# Altium schematic sheet 03200904张晨06.SchDoc
size A4; SheetNumber: 1; SheetTotal: 1
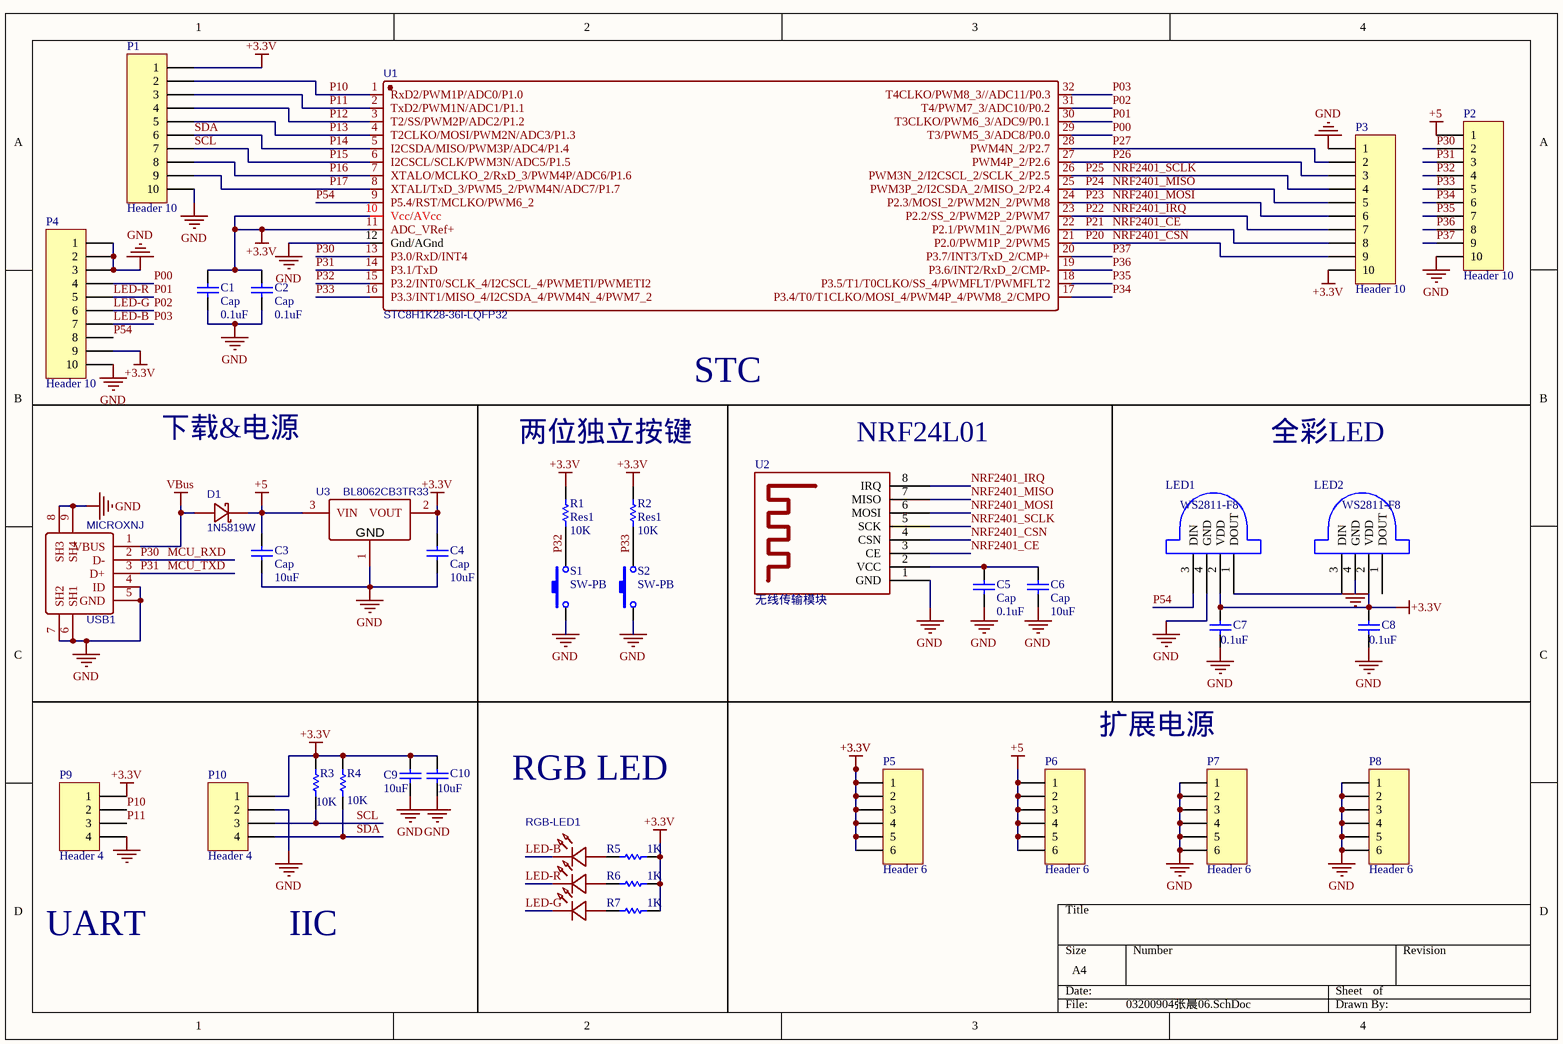
[diagram p0: 03200904张晨06.SchDoc]

## Parts
C1  Cap  value 0.1uF  [C0603]
C2  Cap  value 0.1uF  [C0603]
C3  Cap  value 10uF  [C0603]
C4  Cap  value 10uF  [C0603]
C5  Cap  value 0.1uF  [C0603]
C6  Cap  value 10uF  [C0603]
C7  value 0.1uF  [C0603]  (hidden comment: Cap)
C8  value 0.1uF  [C0603]  (hidden comment: Cap)
C9  value 10uF  [C0603]  (hidden comment: Cap)
C10  value 10uF  [C0603]  (hidden comment: Cap)
D1  1N5819W  [SOD-123_L2.8-W1.8-LS3.7-RD]
LED1  WS2811-F8  [WS2811-F8]
LED2  WS2811-F8  [WS2811-F8]
P1  Header 10  [HDR1X10]
P2  Header 10  [HDR1X10]
P3  Header 10  [HDR1X10]
P4  Header 10  [HDR1X10]
P5  Header 6  [HDR1X6]
P6  Header 6  [HDR1X6]
P7  Header 6  [HDR1X6]
P8  Header 6  [HDR1X6]
P9  Header 4  [HDR1X4]
P10  Header 4  [HDR1X4]
R1  Res1  value 10K  [R0603]
R2  Res1  value 10K  [R0603]
R3  value 10K  [R0603]  (hidden comment: Res1)
R4  value 10K  [R0603]  (hidden comment: Res1)
R5  value 1K  [R0603]  (hidden comment: Res1)
R6  value 1K  [R0603]  (hidden comment: Res1)
R7  value 1K  [R0603]  (hidden comment: Res1)
RGB-LED1  TC5050RGBF20-3CES-AF51  [LED-SMD_6P-L5.0-W5.0-FD]  (value not drawn)
S1  SW-PB  [SW-PB]
S2  SW-PB  [SW-PB]
U1  STC8H1K28-36I-LQFP32  [STC8H1K28I-LQFP-32]
U2  无线传输模块  [无线传输]
U3  BL8062CB3TR33  [SOT-23-3_L2.9-W1.6-P1.90-LS2.8-BR]
USB1  MICROXNJ  [MICRO-USB-SMD_MICROXNJ]

## Nets
+3.3V: C1.1 C2.1 C4.1 C7.1 C8.1 C9.2 C10.2 LED1.2(VDD) LED2.2(VDD) P1.1 P3.10 P4.9 P5.1 P5.2 P5.3 P5.4 P5.5 P5.6 P9.1 P10.1 R1.2 R2.2 R3.1 R4.1 R5.2 R6.2 R7.2 U1.10(Vcc/AVcc) U1.11(ADC_VRef+) U3.2(VOUT)
+5: C3.1 D1.1(C) P2.1 P6.1 P6.2 P6.3 P6.4 P6.5 P6.6 U3.3(VIN)
GND: C1.2 C2.2 C3.2 C4.2 C5.1 C6.1 C7.2 C8.2 C9.1 C10.1 LED1.4(GND) LED2.4(GND) P1.10 P2.10 P3.1 P4.1 P4.2 P4.3 P4.10 P7.1 P7.2 P7.3 P7.4 P7.5 P7.6 P8.1 P8.2 P8.3 P8.4 P8.5 P8.6 P9.4 P10.2 S1.1 S2.1 U1.12(Gnd/AGnd) U2.1(GND) U3.1(GND) USB1.4(ID) USB1.5(GND) USB1.6(SH1) USB1.7(SH2) USB1.8(SH3) USB1.9(SH4)
VBus: D1.2(A) USB1.1(VBUS)
LED-B: P4.7 RGB-LED1.6(K) U1.32(T4CLKO/PWM8_3//ADC11/P0.3)  [also labelled P03]
LED-G: P4.6 RGB-LED1.4(K) U1.31(T4/PWM7_3/ADC10/P0.2)  [also labelled P02]
LED-R: P4.5 RGB-LED1.5(K) U1.30(T3CLKO/PWM6_3/ADC9/P0.1)  [also labelled P01]
MCU_RXD: P2.2 U1.13(P3.0/RxD/INT4) USB1.2(D-)  [also labelled P30]
MCU_TXD: P2.3 U1.14(P3.1/TxD) USB1.3(D+)  [also labelled P31]
NRF2401_CE: P3.8 U1.22(P2.1/PWM1N_2/PWM6) U2.3(CE)  [also labelled P21]
NRF2401_CSN: P3.9 U1.21(P2.0/PWM1P_2/PWM5) U2.4(CSN)  [also labelled P20]
NRF2401_IRQ: P3.7 U1.23(P2.2/SS_2/PWM2P_2/PWM7) U2.8(IRQ)  [also labelled P22]
NRF2401_MISO: P3.5 U1.25(PWM3P_2/I2CSDA_2/MISO_2/P2.4) U2.7(MISO)  [also labelled P24]
NRF2401_MOSI: P3.6 U1.24(P2.3/MOSI_2/PWM2N_2/PWM8) U2.6(MOSI)  [also labelled P23]
NRF2401_SCLK: P3.4 U1.26(PWM3N_2/I2CSCL_2/SCLK_2/P2.5) U2.5(SCK)  [also labelled P25]
P00: P4.4 U1.29(T3/PWM5_3/ADC8/P0.0)
P10: P1.2 P9.2 U1.1(RxD2/PWM1P/ADC0/P1.0)
P11: P1.3 P9.3 U1.2(TxD2/PWM1N/ADC1/P1.1)
P12: P1.4 U1.3(T2/SS/PWM2P/ADC2/P1.2)
P13: P1.5 U1.4(T2CLKO/MOSI/PWM2N/ADC3/P1.3)
P14: P1.6 P10.4 R4.2 U1.5(I2CSDA/MISO/PWM3P/ADC4/P1.4)  [also labelled SDA]
P15: P1.7 P10.3 R3.2 U1.6(I2CSCL/SCLK/PWM3N/ADC5/P1.5)  [also labelled SCL]
P16: P1.8 U1.7(XTALO/MCLKO_2/RxD_3/PWM4P/ADC6/P1.6)
P17: P1.9 U1.8(XTALI/TxD_3/PWM5_2/PWM4N/ADC7/P1.7)
P26: P3.3 U1.27(PWM4P_2/P2.6)
P27: P3.2 U1.28(PWM4N_2/P2.7)
P32: P2.4 U1.15(P3.2/INT0/SCLK_4/I2CSCL_4/PWMETI/PWMETI2)
P33: P2.5 U1.16(P3.3/INT1/MISO_4/I2CSDA_4/PWM4N_4/PWM7_2)
P34: P2.6 U1.17(P3.4/T0/T1CLKO/MOSI_4/PWM4P_4/PWM8_2/CMPO)
P35: P2.7 U1.18(P3.5/T1/T0CLKO/SS_4/PWMFLT/PWMFLT2)
P36: P2.8 U1.19(P3.6/INT2/RxD_2/CMP-)
P37: P2.9 U1.20(P3.7/INT3/TxD_2/CMP+)
P54: LED1.3(DIN) P4.8 U1.9(P5.4/RST/MCLKO/PWM6_2)
NetC5_2: C5.2 C6.2 U2.2(VCC)
NetLED1_1: LED1.1(DOUT) LED2.3(DIN)
NetR1_1: R1.1 S1.2
NetR2_1: R2.1 S2.2
NetR5_1: R5.1 RGB-LED1.1(A)
NetR6_1: R6.1 RGB-LED1.2(A)
NetR7_1: R7.1 RGB-LED1.3(A)

Not connected (* = marked no-connect by the designer): LED2 1(DOUT)

## Notes on the sheet
- STC
- 下载&电源
- 两位独立按键
- (near U2) NRF24L01
- 全彩LED
- RGB LED
- 扩展电源
- UART
- IIC
- Labels drawn without touching a wire or pin: P32, P33

## Library data of the parts
C1-C10 = Cap: Capacitor; Published: 8-Jun-2000; LatestRevisionDate: 17-Jul-2002; LatestRevisionNote: Re-released for DXP Platform.; PackageReference: RAD-0.3; Publisher: Altium Limited; PackageDescription: Radial Cap, Thru-Hole; 2 Leads; 0.3 in Pin Spacing
D1 = 1N5819W_C727115: BOM_Manufacturer: TWGMC; Contributor: LCSC; BOM_Supplier: LCSC; BOM_Supplier Part: C727115; BOM_Manufacturer Part: 1N5819W; BOM_JLCPCB Part Class: Extended Part; spicePre: D; spiceSymbolName: 1N5819W_C727115
P1-P4 = Header 10: Header, 10-Pin; LatestRevisionDate: 17-Jul-2002; LatestRevisionNote: Re-released for DXP Platform.; Publisher: Altium Limited
P5-P8 = Header 6: Header, 6-Pin; LatestRevisionDate: 17-Jul-2002; LatestRevisionNote: Re-released for DXP Platform.; Publisher: Altium Limited
P9 P10 = Header 4: Header, 4-Pin; LatestRevisionDate: 17-Jul-2002; LatestRevisionNote: Re-released for DXP Platform.; Publisher: Altium Limited
R1-R7 = Res: Resistor; Published: 8-Jun-2000; LatestRevisionDate: 17-Jul-2002; LatestRevisionNote: Re-released for DXP Platform.; PackageReference: AXIAL-0.3; Publisher: Altium Limited; PackageDescription: Axial Device, Thru-Hole; 2 Leads; 0.3 in Pin Spacing
RGB-LED1 = TC5050RGBF20-3CES-AF51: BOM_Manufacturer: TCWIN; Contributor: LCSC; BOM_Supplier: LCSC; BOM_Supplier Part: C784541; BOM_Manufacturer Part: TC5050RGBF20-3CES-AF51; BOM_JLCPCB Part Class: Extended Part; spicePre: L; spiceSymbolName: TC5050RGBF20-3CES-AF51
S1 S2 = SW-PB: Switch; Published: 24-Mar-1999; LatestRevisionDate: 17-Jul-2002; LatestRevisionNote: Re-released for DXP Platform.; PackageReference: SPST-2; Publisher: Altium Limited; PackageDescription: Switch; 2 Leads
U1 = STC8H1K28-36I-LQFP32: BOM_Manufacturer: STC Micro; Contributor: LCSC; BOM_Supplier: LCSC; BOM_Supplier Part: C914618; BOM_Manufacturer Part: STC8H1K28-36I-LQFP32; BOM_JLCPCB Part Class: Extended Part; spicePre: U; spiceSymbolName: STC8H1K28-36I-LQFP32
U3 = BL8062CB3TR33: BOM_Manufacturer: BL(Shanghai Belling); Contributor: LCSC; BOM_Supplier: LCSC; BOM_Supplier Part: C692265; BOM_Manufacturer Part: BL8062CB3TR33; BOM_JLCPCB Part Class: Extended Part; spicePre: U; spiceSymbolName: BL8062CB3TR33
USB1 = MICROXNJ: BOM_Manufacturer: SHOU HAN; Contributor: LCSC; BOM_Supplier: LCSC; BOM_Supplier Part: C404969; BOM_Manufacturer Part: MicroXNJ; BOM_JLCPCB Part Class: Extended Part; spicePre: U; spiceSymbolName: MICROXNJ